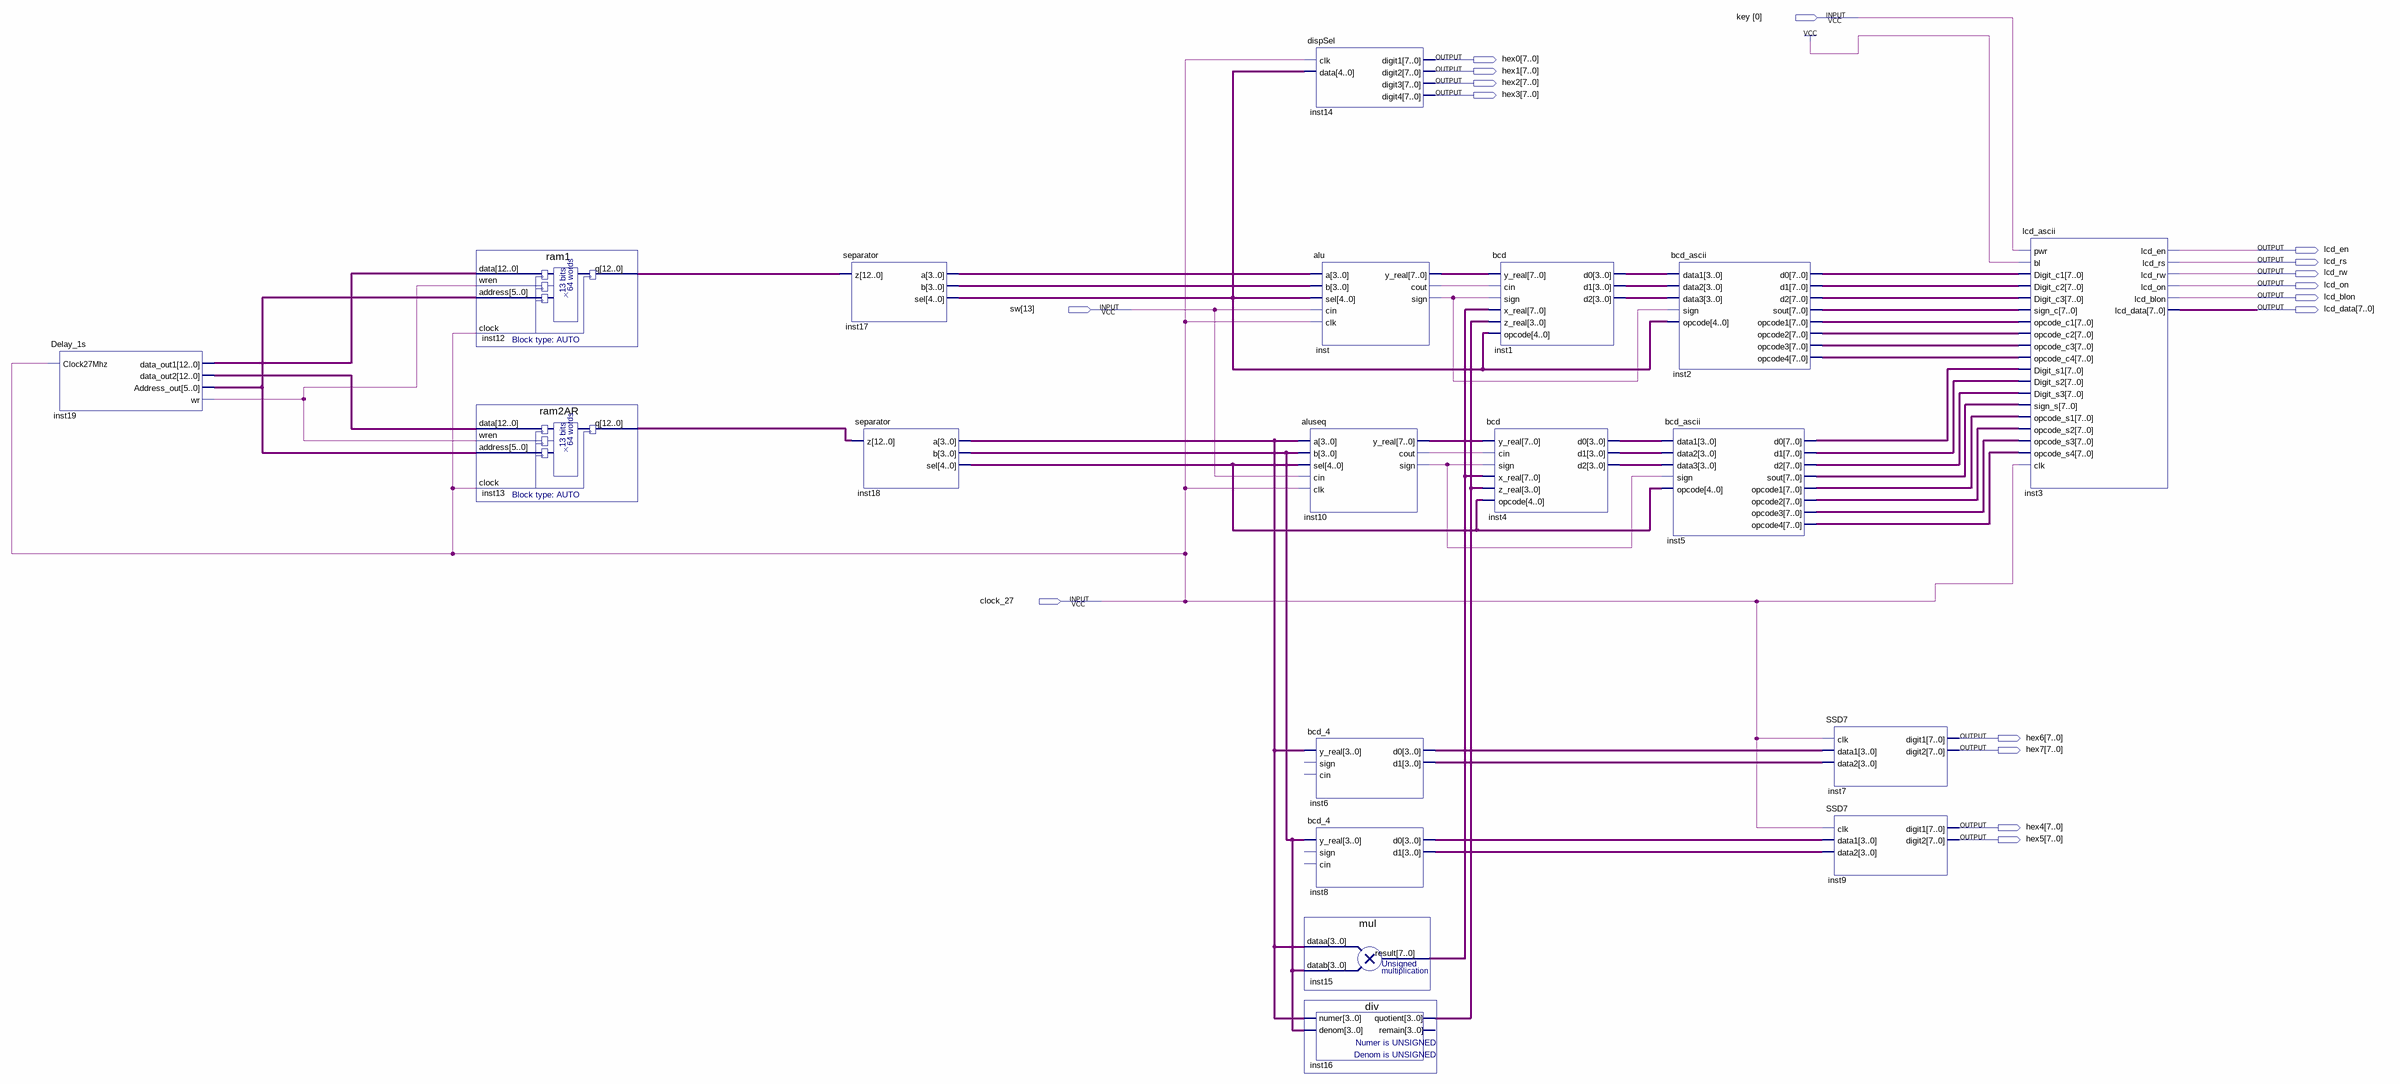
[diagram p0: schematic sheet]
// Quartus schematic lab1.bdf as structural Verilog: 19 symbols, 17 pins
module lab1 (
  input  [0:0] key,
  input  [13:13] sw,
  input  clock_27,
  output [7:0] hex0,
  output [7:0] hex1,
  output [7:0] hex2,
  output [7:0] hex3,
  output lcd_en,
  output lcd_rs,
  output lcd_rw,
  output lcd_on,
  output lcd_blon,
  output [7:0] lcd_data,
  output [7:0] hex6,
  output [7:0] hex7,
  output [7:0] hex4,
  output [7:0] hex5
);

  wire inst10_cout, inst10_sign, inst19_wr, inst_cout, inst_sign;
  wire [3:0] inst1_d0, inst1_d1, inst1_d2, inst4_d0, inst4_d1, inst4_d2, inst6_d0, inst6_d1, inst8_d0,
       inst8_d1, inst16_quotient, inst17_a, inst17_b, inst18_a, inst18_b;
  wire [4:0] inst17_sel, inst18_sel;
  wire [5:0] inst19_address_out;
  wire [7:0] inst2_d0, inst2_d1, inst2_d2, inst2_opcode1, inst2_opcode2, inst2_opcode3, inst2_opcode4,
       inst2_sout, inst5_d0, inst5_d1, inst5_d2, inst5_opcode1, inst5_opcode2, inst5_opcode3, inst5_opcode4,
       inst5_sout, inst10_y_real, inst15_result, inst_y_real;
  wire [12:0] inst12_q, inst13_q, inst19_data_out1, inst19_data_out2;

  Delay_1s inst19 (
    .Clock27Mhz(clock_27), .data_out1(inst19_data_out1), .data_out2(inst19_data_out2),
    .Address_out(inst19_address_out), .wr(inst19_wr));
  ram1 inst12 (.data(inst19_data_out1), .wren(inst19_wr), .address(inst19_address_out), .clock(clock_27), .q(inst12_q));
  ram2AR inst13 (
    .data(inst19_data_out2), .wren(inst19_wr), .address(inst19_address_out), .clock(clock_27), .q(inst13_q));
  separator inst17 (.z(inst12_q), .a(inst17_a), .b(inst17_b), .sel(inst17_sel));
  separator inst18 (.z(inst13_q), .a(inst18_a), .b(inst18_b), .sel(inst18_sel));
  dispSel inst14 (.clk(clock_27), .data(inst17_sel), .digit1(hex0), .digit2(hex1), .digit3(hex2), .digit4(hex3));
  alu inst (
    .a(inst17_a), .b(inst17_b), .sel(inst17_sel), .cin(sw[13]), .clk(clock_27), .y_real(inst_y_real),
    .cout(inst_cout), .sign(inst_sign));
  aluseq inst10 (
    .a(inst18_a), .b(inst18_b), .sel(inst18_sel), .cin(sw[13]), .clk(clock_27), .y_real(inst10_y_real),
    .cout(inst10_cout), .sign(inst10_sign));
  bcd_4 inst6 (.y_real(inst18_a), .d0(inst6_d0), .d1(inst6_d1));  // open: sign, cin
  bcd_4 inst8 (.y_real(inst18_b), .d0(inst8_d0), .d1(inst8_d1));  // open: sign, cin
  mul inst15 (.dataa(inst18_a), .datab(inst18_b), .result(inst15_result));
  div inst16 (.numer(inst18_a), .denom(inst18_b), .quotient(inst16_quotient));  // open: remain
  bcd inst1 (
    .y_real(inst_y_real), .cin(inst_cout), .sign(inst_sign), .x_real(inst15_result),
    .z_real(inst16_quotient), .opcode(inst17_sel), .d0(inst1_d0), .d1(inst1_d1), .d2(inst1_d2));
  bcd inst4 (
    .y_real(inst10_y_real), .cin(inst10_cout), .sign(inst10_sign), .x_real(inst15_result),
    .z_real(inst16_quotient), .opcode(inst18_sel), .d0(inst4_d0), .d1(inst4_d1), .d2(inst4_d2));
  bcd_ascii inst2 (
    .data1(inst1_d0), .data2(inst1_d1), .data3(inst1_d2), .sign(inst_sign), .opcode(inst17_sel),
    .d0(inst2_d0), .d1(inst2_d1), .d2(inst2_d2), .sout(inst2_sout), .opcode1(inst2_opcode1),
    .opcode2(inst2_opcode2), .opcode3(inst2_opcode3), .opcode4(inst2_opcode4));
  bcd_ascii inst5 (
    .data1(inst4_d0), .data2(inst4_d1), .data3(inst4_d2), .sign(inst10_sign), .opcode(inst18_sel),
    .d0(inst5_d0), .d1(inst5_d1), .d2(inst5_d2), .sout(inst5_sout), .opcode1(inst5_opcode1),
    .opcode2(inst5_opcode2), .opcode3(inst5_opcode3), .opcode4(inst5_opcode4));
  SSD7 inst7 (.clk(clock_27), .data1(inst6_d0), .data2(inst6_d1), .digit1(hex6), .digit2(hex7));
  SSD7 inst9 (.clk(clock_27), .data1(inst8_d0), .data2(inst8_d1), .digit1(hex4), .digit2(hex5));
  lcd_ascii inst3 (
    .pwr(key[0]), .bl(1'b1), .Digit_c1(inst2_d0), .Digit_c2(inst2_d1), .Digit_c3(inst2_d2),
    .sign_c(inst2_sout), .opcode_c1(inst2_opcode1), .opcode_c2(inst2_opcode2), .opcode_c3(inst2_opcode3),
    .opcode_c4(inst2_opcode4), .Digit_s1(inst5_d0), .Digit_s2(inst5_d1), .Digit_s3(inst5_d2),
    .sign_s(inst5_sout), .opcode_s1(inst5_opcode1), .opcode_s2(inst5_opcode2), .opcode_s3(inst5_opcode3),
    .opcode_s4(inst5_opcode4), .clk(clock_27), .lcd_en(lcd_en), .lcd_rs(lcd_rs), .lcd_rw(lcd_rw),
    .lcd_on(lcd_on), .lcd_blon(lcd_blon), .lcd_data(lcd_data));
endmodule
